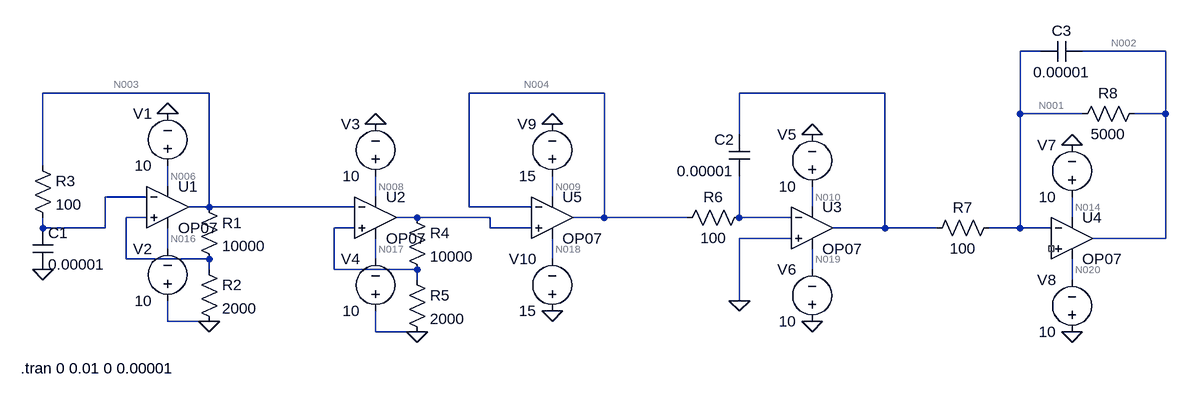
[diagram p0: schematic Function_Generator.asc]
Function_Generator.asc, the LTspice schematic file:
Version 4
SHEET 1 888 680
WIRE 688 -144 656 -144
WIRE 880 -144 752 -144
WIRE -592 -80 -848 -80
WIRE 16 -80 -192 -80
WIRE 448 -80 224 -80
WIRE 656 -48 656 -144
WIRE 752 -48 656 -48
WIRE 880 -48 880 -144
WIRE 880 -48 832 -48
WIRE 224 -16 224 -80
WIRE -848 32 -848 -80
WIRE -656 64 -656 32
WIRE -688 80 -752 80
WIRE -336 80 -336 48
WIRE -64 80 -64 48
WIRE -592 96 -592 -80
WIRE -592 96 -624 96
WIRE -368 96 -592 96
WIRE -192 96 -192 -80
WIRE -96 96 -192 96
WIRE 336 96 336 64
WIRE -688 112 -720 112
WIRE -272 112 -304 112
WIRE -160 112 -272 112
WIRE 16 112 16 -80
WIRE 16 112 -32 112
WIRE 144 112 16 112
WIRE 224 112 224 48
WIRE 304 112 224 112
WIRE 736 112 736 80
WIRE -848 128 -848 112
WIRE -752 128 -752 80
WIRE -752 128 -848 128
WIRE -368 128 -400 128
WIRE -160 128 -160 112
WIRE -96 128 -160 128
WIRE 448 128 448 -80
WIRE 448 128 368 128
WIRE 528 128 448 128
WIRE 656 128 656 -48
WIRE 656 128 608 128
WIRE 704 128 656 128
WIRE 304 144 224 144
WIRE 880 144 880 -48
WIRE 880 144 768 144
WIRE -656 160 -656 128
WIRE -720 176 -720 112
WIRE -592 176 -720 176
WIRE -336 176 -336 144
WIRE -64 176 -64 144
WIRE -592 192 -592 176
WIRE -400 192 -400 128
WIRE -272 192 -400 192
WIRE 336 192 336 160
WIRE -272 208 -272 192
WIRE 736 208 736 176
WIRE 224 240 224 144
WIRE -656 272 -656 240
WIRE -592 272 -656 272
WIRE -336 288 -336 256
WIRE -272 288 -336 288
FLAG -592 272 0
FLAG -656 -48 0
FLAG -848 192 0
FLAG -272 288 0
FLAG -336 -32 0
FLAG 336 -16 0
FLAG 336 272 0
FLAG 736 0 0
FLAG 736 288 0
FLAG 224 240 0
FLAG -64 -32 0
FLAG -64 256 0
SYMBOL res -608 80 R0
SYMATTR InstName R1
SYMATTR Value 10000
SYMBOL res -608 176 R0
SYMATTR InstName R2
SYMATTR Value 2000
SYMBOL Opamps\\OP07 -656 32 R0
SYMATTR InstName U1
SYMBOL voltage -656 48 R180
WINDOW 0 24 96 Left 2
WINDOW 3 24 16 Left 2
WINDOW 123 0 0 Left 2
WINDOW 39 0 0 Left 2
SYMATTR InstName V1
SYMATTR Value 10
SYMBOL voltage -656 256 R180
WINDOW 0 24 96 Left 2
WINDOW 3 24 16 Left 2
WINDOW 123 0 0 Left 2
WINDOW 39 0 0 Left 2
SYMATTR InstName V2
SYMATTR Value 10
SYMBOL res -864 16 R0
SYMATTR InstName R3
SYMATTR Value 100
SYMBOL cap -864 128 R0
SYMATTR InstName C1
SYMATTR Value 0.00001
SYMBOL res -288 96 R0
SYMATTR InstName R4
SYMATTR Value 10000
SYMBOL res -288 192 R0
SYMATTR InstName R5
SYMATTR Value 2000
SYMBOL Opamps\\OP07 -336 48 R0
SYMATTR InstName U2
SYMBOL voltage -336 64 R180
WINDOW 0 24 96 Left 2
WINDOW 3 24 16 Left 2
WINDOW 123 0 0 Left 2
WINDOW 39 0 0 Left 2
SYMATTR InstName V3
SYMATTR Value 10
SYMBOL voltage -336 272 R180
WINDOW 0 24 96 Left 2
WINDOW 3 24 16 Left 2
WINDOW 123 0 0 Left 2
WINDOW 39 0 0 Left 2
SYMATTR InstName V4
SYMATTR Value 10
SYMBOL Opamps\\OP07 336 64 R0
SYMATTR InstName U3
SYMBOL voltage 336 80 R180
WINDOW 0 24 96 Left 2
WINDOW 3 24 16 Left 2
WINDOW 123 0 0 Left 2
WINDOW 39 0 0 Left 2
SYMATTR InstName V5
SYMATTR Value 10
SYMBOL voltage 336 288 R180
WINDOW 0 24 96 Left 2
WINDOW 3 24 16 Left 2
WINDOW 123 0 0 Left 2
WINDOW 39 0 0 Left 2
SYMATTR InstName V6
SYMATTR Value 10
SYMBOL Opamps\\OP07 736 80 R0
SYMATTR InstName U4
SYMBOL voltage 736 96 R180
WINDOW 0 24 96 Left 2
WINDOW 3 24 16 Left 2
WINDOW 123 0 0 Left 2
WINDOW 39 0 0 Left 2
SYMATTR InstName V7
SYMATTR Value 10
SYMBOL voltage 736 304 R180
WINDOW 0 24 96 Left 2
WINDOW 3 24 16 Left 2
WINDOW 123 0 0 Left 2
WINDOW 39 0 0 Left 2
SYMATTR InstName V8
SYMATTR Value 10
SYMBOL res 240 96 R90
WINDOW 0 0 56 VBottom 2
WINDOW 3 32 56 VTop 2
SYMATTR InstName R6
SYMATTR Value 100
SYMBOL cap 240 -16 M0
SYMATTR InstName C2
SYMATTR Value 0.00001
SYMBOL res 624 112 R90
WINDOW 0 0 56 VBottom 2
WINDOW 3 32 56 VTop 2
SYMATTR InstName R7
SYMATTR Value 100
SYMBOL res 848 -64 R90
WINDOW 0 0 56 VBottom 2
WINDOW 3 32 56 VTop 2
SYMATTR InstName R8
SYMATTR Value 5000
SYMBOL cap 752 -160 R90
WINDOW 0 0 32 VBottom 2
WINDOW 3 32 32 VTop 2
SYMATTR InstName C3
SYMATTR Value 0.00001
SYMBOL Opamps\\OP07 -64 48 R0
SYMATTR InstName U5
SYMBOL voltage -64 64 R180
WINDOW 0 24 96 Left 2
WINDOW 3 24 16 Left 2
WINDOW 123 0 0 Left 2
WINDOW 39 0 0 Left 2
SYMATTR InstName V9
SYMATTR Value 15
SYMBOL voltage -64 272 R180
WINDOW 0 24 96 Left 2
WINDOW 3 24 16 Left 2
WINDOW 123 0 0 Left 2
WINDOW 39 0 0 Left 2
SYMATTR InstName V10
SYMATTR Value 15
TEXT -882 344 Left 2 !.tran 0 0.01 0 0.00001

The netlist it stands for:
* Function_Generator.asc
R1 N003 N011 10000
R2 N011 0 2000
XU1 N011 N007 N006 N016 N003 LT1001  ; OP07, pins In+ In- V+ V- OUT
V1 N006 0 10
V2 0 N016 10
R3 N003 N007 100
C1 N007 0 0.00001
R4 N012 N015 10000
R5 N015 0 2000
XU2 N015 N003 N008 N017 N012 LT1001  ; OP07, pins In+ In- V+ V- OUT
V3 N008 0 10
V4 0 N017 10
XU3 0 N013 N010 N019 N005 LT1001  ; OP07, pins In+ In- V+ V- OUT
V5 N010 0 10
V6 0 N019 10
XU4 NC_01 N001 N014 N020 N002 LT1001  ; OP07, pins In+ In- V+ V- OUT
V7 N014 0 10
V8 0 N020 10
R6 N013 N004 100
C2 N005 N013 0.00001
R7 N001 N005 100
R8 N002 N001 5000
C3 N002 N001 0.00001
XU5 N012 N004 N009 N018 N004 LT1001  ; OP07, pins In+ In- V+ V- OUT
V9 N009 0 15
V10 0 N018 15
.tran 0 0.01 0 0.00001
.lib LTC.lib
.backanno
.end

* Results of the author's LTspice run, read from the files saved beside the schematic
* Operating Point, zero values left out:
*   V(n006) = 10 V
*   V(n016) = -10 V
*   V(n008) = 10 V
*   V(n017) = -10 V
*   V(n010) = 10 V
*   V(n019) = -10 V
*   V(n014) = 10 V
*   V(n020) = -10 V
*   V(n009) = 15 V
*   V(n018) = -15 V
*   I(V10) = -2.25 mA
*   I(V9) = -2.25 mA
*   I(V8) = -2.25 mA
*   I(V7) = -2.25 mA
*   I(V6) = -2.25 mA
*   I(V5) = -2.25 mA
*   I(V4) = -2.25 mA
*   I(V3) = -2.25 mA
*   I(V2) = -2.25 mA
*   I(V1) = -2.25 mA
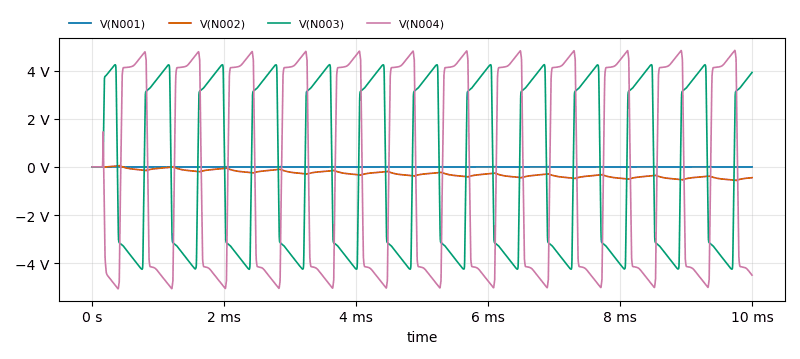
[diagram p1: Transient Analysis of Function_Generator.asc, plotted from the saved traces]
* Transient Analysis, 1 run:
*   V(N001): min -13.86 mV, max 15.78 mV, average 792.9 µV, rms 1.979 mV, last 919 µV
*   V(N002): min -563.3 mV, max 58.17 mV, average -281.5 mV, rms 317.6 mV, last -446.6 mV
*   V(N003): min -4.259 V, max 4.259 V, average 27.79 mV, rms 3.559 V, last 3.932 V
*   V(N004): min -5.071 V, max 4.853 V, average -88.63 mV, rms 4.233 V, last -4.503 V